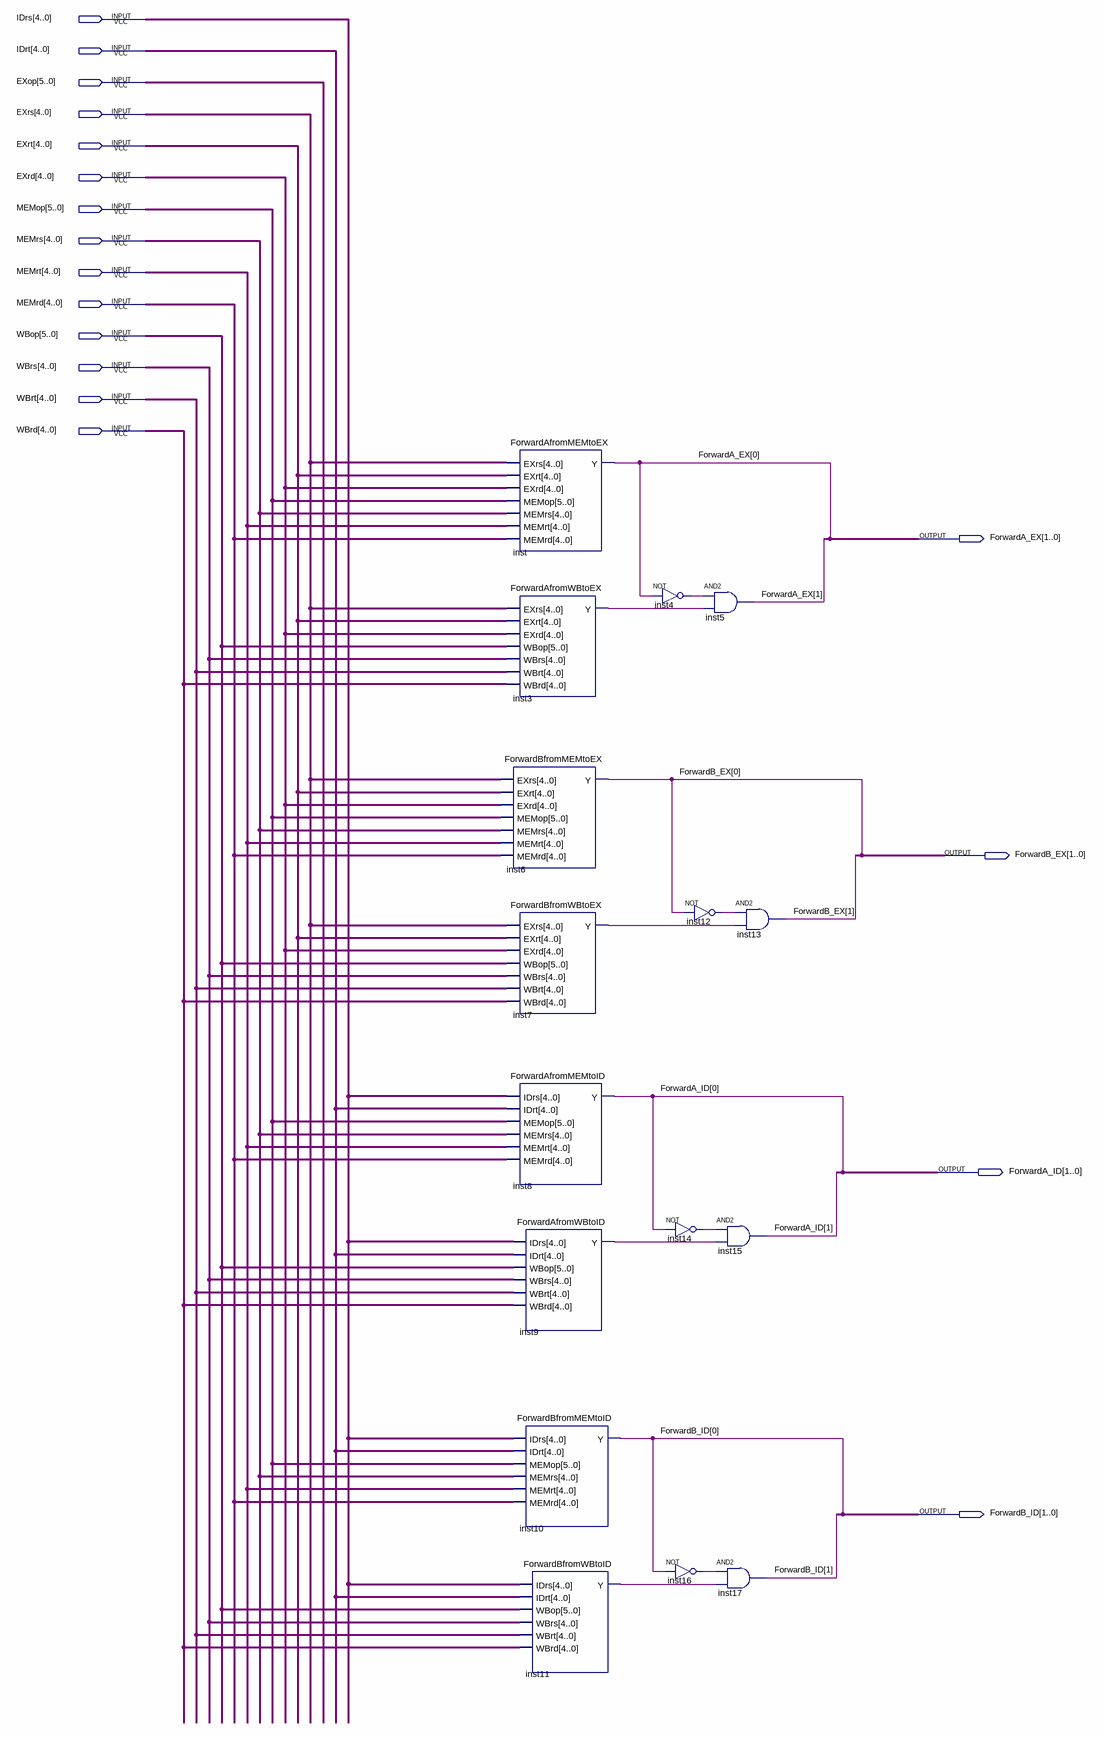
[diagram p0: schematic sheet]
// Quartus schematic ForwardDetection.bdf as structural Verilog: 16 symbols, 18 pins
module ForwardDetection (
  input  [4:0] IDrs,
  input  [4:0] IDrt,
  input  [5:0] EXop,
  input  [4:0] EXrs,
  input  [4:0] EXrt,
  input  [4:0] EXrd,
  input  [5:0] MEMop,
  input  [4:0] MEMrs,
  input  [4:0] MEMrt,
  input  [4:0] MEMrd,
  input  [5:0] WBop,
  input  [4:0] WBrs,
  input  [4:0] WBrt,
  input  [4:0] WBrd,
  output [1:0] ForwardA_EX,
  output [1:0] ForwardB_EX,
  output [1:0] ForwardA_ID,
  output [1:0] ForwardB_ID
);

  wire inst3_y, inst4_out, inst7_y, inst9_y, inst11_y, inst12_out, inst14_out, inst16_out;

  ForwardAfromMEMtoEX inst (
    .EXrs(EXrs), .EXrt(EXrt), .EXrd(EXrd), .MEMop(MEMop), .MEMrs(MEMrs), .MEMrt(MEMrt), .MEMrd(MEMrd),
    .Y(ForwardA_EX[0]));
  ForwardAfromWBtoEX inst3 (
    .EXrs(EXrs), .EXrt(EXrt), .EXrd(EXrd), .WBop(WBop), .WBrs(WBrs), .WBrt(WBrt), .WBrd(WBrd), .Y(inst3_y));
  ForwardBfromMEMtoEX inst6 (
    .EXrs(EXrs), .EXrt(EXrt), .EXrd(EXrd), .MEMop(MEMop), .MEMrs(MEMrs), .MEMrt(MEMrt), .MEMrd(MEMrd),
    .Y(ForwardB_EX[0]));
  ForwardBfromWBtoEX inst7 (
    .EXrs(EXrs), .EXrt(EXrt), .EXrd(EXrd), .WBop(WBop), .WBrs(WBrs), .WBrt(WBrt), .WBrd(WBrd), .Y(inst7_y));
  ForwardAfromMEMtoID inst8 (
    .IDrs(IDrs), .IDrt(IDrt), .MEMop(MEMop), .MEMrs(MEMrs), .MEMrt(MEMrt), .MEMrd(MEMrd), .Y(ForwardA_ID[0]));
  ForwardAfromWBtoID inst9 (.IDrs(IDrs), .IDrt(IDrt), .WBop(WBop), .WBrs(WBrs), .WBrt(WBrt), .WBrd(WBrd), .Y(inst9_y));
  ForwardBfromMEMtoID inst10 (
    .IDrs(IDrs), .IDrt(IDrt), .MEMop(MEMop), .MEMrs(MEMrs), .MEMrt(MEMrt), .MEMrd(MEMrd), .Y(ForwardB_ID[0]));
  ForwardBfromWBtoID inst11 (
    .IDrs(IDrs), .IDrt(IDrt), .WBop(WBop), .WBrs(WBrs), .WBrt(WBrt), .WBrd(WBrd), .Y(inst11_y));
  not inst4 (inst4_out, ForwardA_EX[0]);
  not inst12 (inst12_out, ForwardB_EX[0]);
  not inst14 (inst14_out, ForwardA_ID[0]);
  not inst16 (inst16_out, ForwardB_ID[0]);
  and inst5 (ForwardA_EX[1], inst4_out, inst3_y);
  and inst13 (ForwardB_EX[1], inst12_out, inst7_y);
  and inst15 (ForwardA_ID[1], inst14_out, inst9_y);
  and inst17 (ForwardB_ID[1], inst16_out, inst11_y);
endmodule
